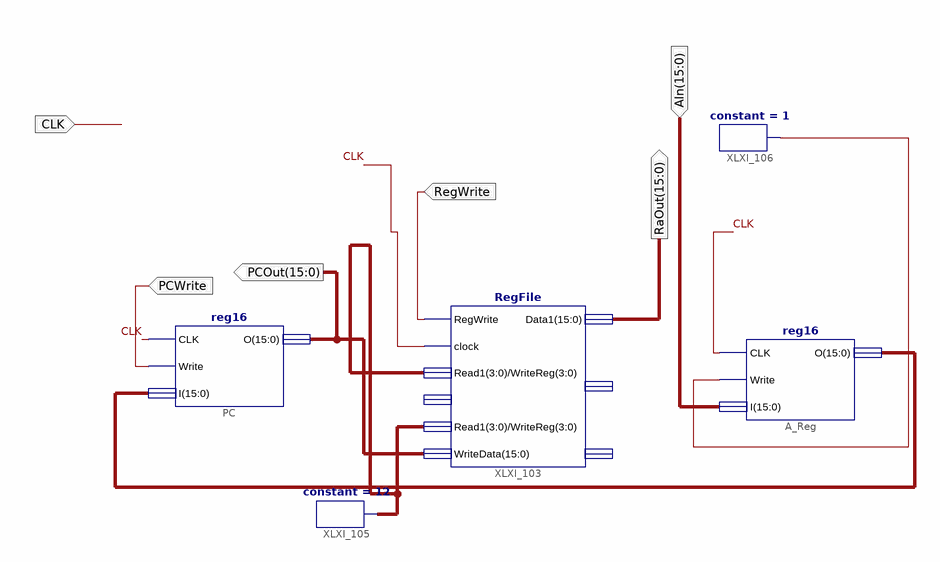
[diagram p0: schematic sheet 1]
// Xilinx ISE schematic PCReg.sch (spartan3adsp) as structural Verilog: 5 symbols, 6 ports
module PCReg (
  input  CLK,
  input  RegWrite,
  input  [15:0] AIn,
  input  PCWrite,
  output [15:0] PCOut,
  output [15:0] RaOut
);

  wire XLXN_11;
  wire [3:0] XLXN_2;
  wire [15:0] XLXN_5;

  reg16 PC (.CLK(CLK), .Write(PCWrite), .I(XLXN_5), .O(PCOut));
  RegFile XLXI_103 (
    .RegWrite(RegWrite), .clock(CLK), .Read1(XLXN_2), .WriteReg(XLXN_2), .WriteData(PCOut), .Data1(RaOut));  // open: Read2, Data2, Data3
  reg16 A_Reg (.CLK(CLK), .Write(XLXN_11), .I(AIn), .O(XLXN_5));
  constant #(.CValue("12")) XLXI_105 (.O(XLXN_2));
  constant #(.CValue("1")) XLXI_106 (.O(XLXN_11));
endmodule
